# Altium schematic sheet ttl.SchDoc: TTL
size A4; Author: Marcel Hellwig; Organization: Hamburg Bit-Bots; Address1: Vogt-Kölln-Str. 30; Address2: 22527 Hamburg; Address3: Germany; Address4: www.bit-bots.de; DocumentNumber: 13; Revision: A; SheetNumber: 13; SheetTotal: 16; EMail: info@bit-bots.de
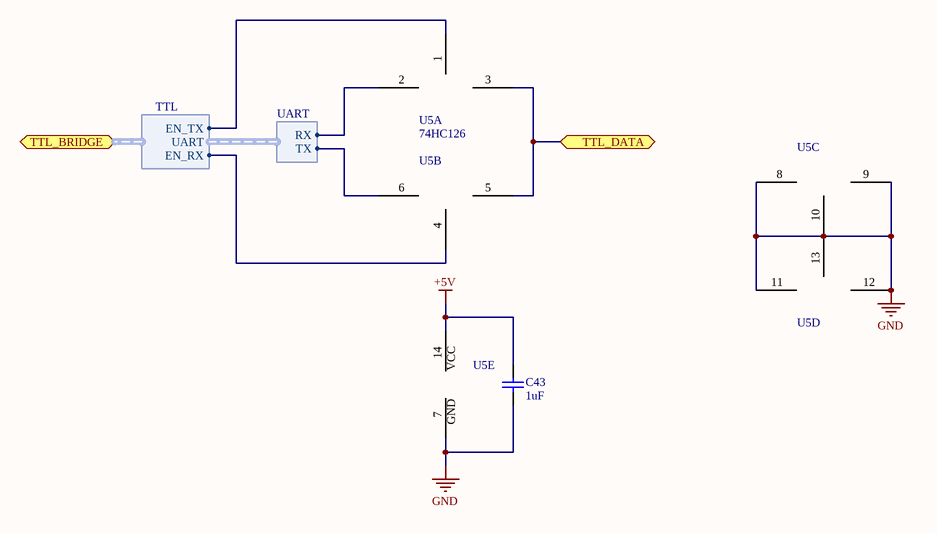
[diagram p0: ttl.SchDoc]

## Parts
C43  1uF  [C2012]
U5  74HC126  [SOIC14]  (parts A,B,C,D,E of 5)

## Ports
TTL_BRIDGE (harness TTL), TTL_DATA (bidir)

## Harnesses
TTL: UART, EN_RX, EN_TX
UART: RX, TX

## Nets
+5V: C43.1 U5.14(VCC)
GND: C43.2 U5.7(GND) U5.8(Y3) U5.9(A3) U5.10(OE3) U5.11(Y4) U5.12(A4) U5.13(OE4)
TTL_DATA: U5.3(Y1) U5.5(A2) ; port TTL_DATA
NetU5_1: U5.1(OE1) ; port TTL_BRIDGE.EN_TX
NetU5_2: U5.2(A1) ; harness UART.RX
NetU5_4: U5.4(OE2) ; port TTL_BRIDGE.EN_RX
NetU5_6: U5.6(Y2) ; harness UART.TX

## Notes on the sheet
- Project:
- Author:
- Title:
- Rev:
- Date:
- Time:
- Sheet
- of

## Library data of the parts
C43 = Cap: Capacitor; Manufacturer: MULTICOMP; Manufacturer Part Number: MC0805B105K250CT; Produktpalette: Baureihe MC; Kapazität: 1; Kapazitätstoleranz: ±10%; Dielektrikum: X7; Nennspannung: 25; Keramikkondensatorgehäuse: 0805 [Metrisch 2012]; Betriebstemperatur, min.: -55; Betriebstemperatur, max.: 125; Verpackung: Gurtabschnitt; Kondensatoranschlüsse: SMD<!--FANDB--><div class="features-and-benefits-container"></div>; Published: 8-Jun-2000; LatestRevisionDate: 17-Jul-2002; LatestRevisionNote: Re-released for DXP Platform.; PackageReference: RAD-0.3; Publisher: Altium Limited; PackageDescription: Radial Cap, Thru-Hole; 2 Leads; 0.3 in Pin Spacing; Value: 1uF; Supplier 1: Farnell; Supplier Part Number 1: 2320827; RoHS: YES; Stock 1: 4031; Pricing 1: 10=0,06, 100=0,05, 500=0,041, 1000=0,034, 1500=0,027 (EUR); MSL: MSL 1 - unbegrenzt; Bauform: 0805 [Metrisch 2012]; Kapazitätstoleranz ±: ±10%; ComponentLink1URL: http://www.farnell.com/datasheets/1870456.pdf; ComponentLink1Description: http://www.farnell.com/datasheets/1870456.pdf
U5 = 74HC126: Quad 3-State Noninverting Buffer; Manufacturer: NXP; Manufacturer Part Number: 74HC126D; Supplier 1: Farnell; Supplier Part Number 1: 1085233; RoHS: YES; Stock 1: 198; Pricing 1: 1=0,444, 10=0,311, 100=0,214, 200=0,193, 500=0,173, 2000=0,155, 5000=0,0826, 20000=0,0733 (EUR); ComponentLink1URL: http://www.farnell.com/datasheets/1852048.pdf; ComponentLink1Description: http://www.farnell.com/datasheets/1852048.pdf; ComponentLink2URL: http://www.farnell.com/cad/1638396.zip; ComponentLink2Description: http://www.farnell.com/cad/1638396.zip